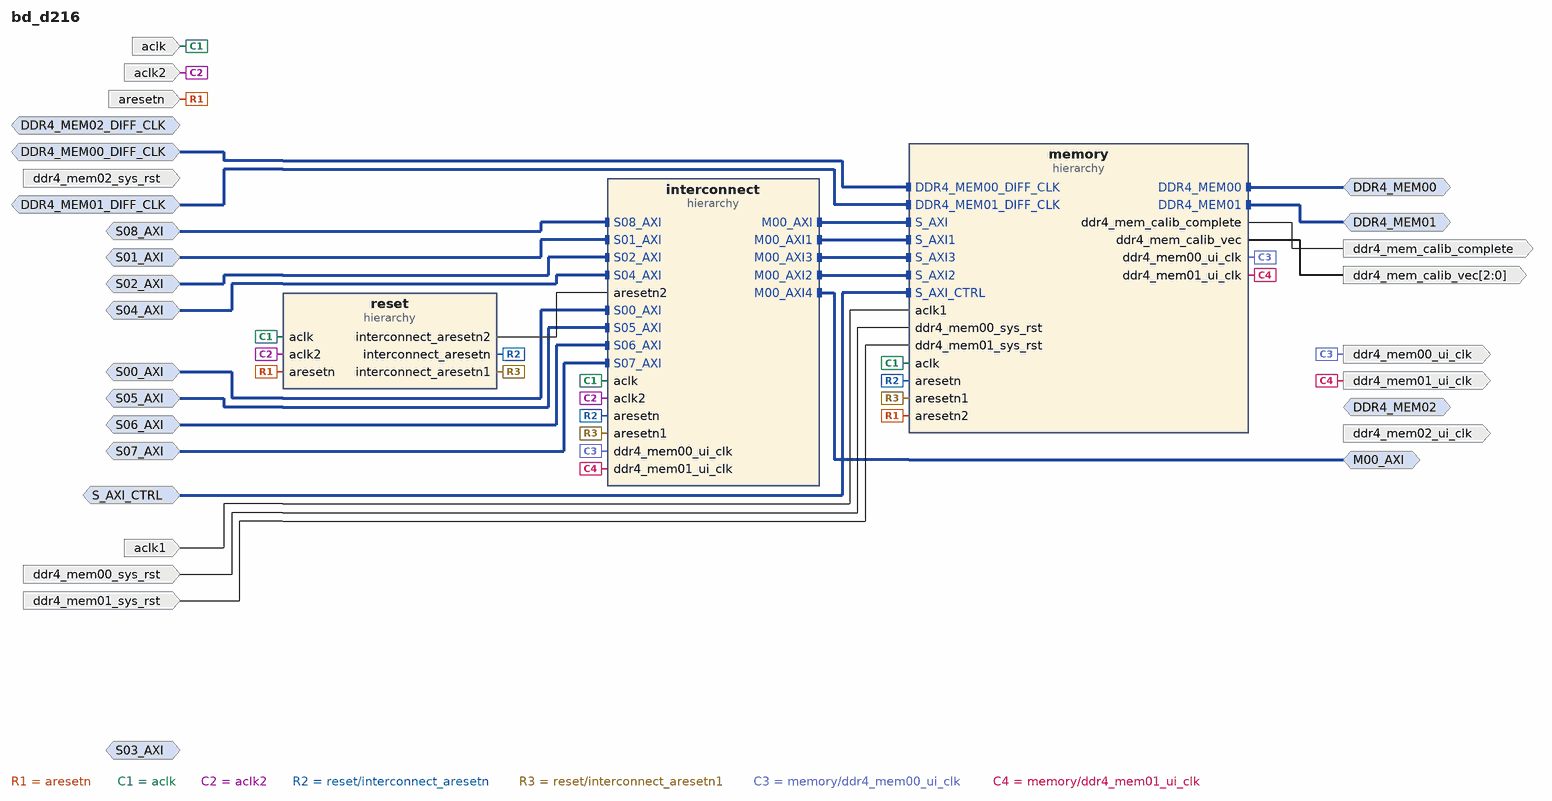
[diagram p0: block diagram of the top level]
# Vivado block design bd_d216, xcu200-fsgd2104-2-e, Vivado 2020.2
create_bd_design bd_d216

create_bd_intf_port -mode Slave -vlnv xilinx.com:interface:aximm_rtl:1.0 S_AXI_CTRL
set_property -dict {CONFIG.ADDR_WIDTH 25 CONFIG.PROTOCOL AXI4LITE} [get_bd_intf_ports S_AXI_CTRL]
create_bd_intf_port -mode Slave -vlnv xilinx.com:interface:aximm_rtl:1.0 S00_AXI
set_property -dict {CONFIG.ADDR_WIDTH 39} [get_bd_intf_ports S00_AXI]
create_bd_intf_port -mode Slave -vlnv xilinx.com:interface:aximm_rtl:1.0 S01_AXI
set_property -dict {CONFIG.ADDR_WIDTH 39} [get_bd_intf_ports S01_AXI]
create_bd_intf_port -mode Slave -vlnv xilinx.com:interface:aximm_rtl:1.0 S02_AXI
set_property -dict {CONFIG.ADDR_WIDTH 39} [get_bd_intf_ports S02_AXI]
create_bd_intf_port -mode Slave -vlnv xilinx.com:interface:aximm_rtl:1.0 S03_AXI
set_property -dict {CONFIG.ADDR_WIDTH 39} [get_bd_intf_ports S03_AXI]
create_bd_intf_port -mode Slave -vlnv xilinx.com:interface:aximm_rtl:1.0 S04_AXI
set_property -dict {CONFIG.ADDR_WIDTH 38} [get_bd_intf_ports S04_AXI]
create_bd_intf_port -mode Slave -vlnv xilinx.com:interface:aximm_rtl:1.0 S05_AXI
set_property -dict {CONFIG.ADDR_WIDTH 39} [get_bd_intf_ports S05_AXI]
create_bd_intf_port -mode Slave -vlnv xilinx.com:interface:aximm_rtl:1.0 S06_AXI
set_property -dict {CONFIG.ADDR_WIDTH 39} [get_bd_intf_ports S06_AXI]
create_bd_intf_port -mode Slave -vlnv xilinx.com:interface:aximm_rtl:1.0 S07_AXI
set_property -dict {CONFIG.ADDR_WIDTH 39} [get_bd_intf_ports S07_AXI]
create_bd_intf_port -mode Slave -vlnv xilinx.com:interface:aximm_rtl:1.0 S08_AXI
set_property -dict {CONFIG.ADDR_WIDTH 38} [get_bd_intf_ports S08_AXI]
create_bd_intf_port -mode Master -vlnv xilinx.com:interface:ddr4_rtl:1.0 DDR4_MEM00
create_bd_intf_port -mode Master -vlnv xilinx.com:interface:ddr4_rtl:1.0 DDR4_MEM01
create_bd_intf_port -mode Master -vlnv xilinx.com:interface:ddr4_rtl:1.0 DDR4_MEM02
create_bd_intf_port -mode Slave -vlnv xilinx.com:interface:diff_clock_rtl:1.0 DDR4_MEM00_DIFF_CLK
set_property -dict {CONFIG.FREQ_HZ 300000000} [get_bd_intf_ports DDR4_MEM00_DIFF_CLK]
create_bd_intf_port -mode Slave -vlnv xilinx.com:interface:diff_clock_rtl:1.0 DDR4_MEM01_DIFF_CLK
set_property -dict {CONFIG.FREQ_HZ 300000000} [get_bd_intf_ports DDR4_MEM01_DIFF_CLK]
create_bd_intf_port -mode Slave -vlnv xilinx.com:interface:diff_clock_rtl:1.0 DDR4_MEM02_DIFF_CLK
set_property -dict {CONFIG.FREQ_HZ 300000000} [get_bd_intf_ports DDR4_MEM02_DIFF_CLK]
create_bd_intf_port -mode Master -vlnv xilinx.com:interface:aximm_rtl:1.0 M00_AXI
set_property -dict {CONFIG.ADDR_WIDTH 39} [get_bd_intf_ports M00_AXI]
create_bd_port -dir I -type clk aclk
set_property -dict [list \
  CONFIG.ASSOCIATED_BUSIF S00_AXI:S01_AXI:S02_AXI:S03_AXI:S04_AXI:S05_AXI:S06_AXI:S07_AXI:S08_AXI \
] [get_bd_ports aclk]
create_bd_port -dir I -type clk aclk1
set_property -dict {CONFIG.ASSOCIATED_BUSIF S_AXI_CTRL} [get_bd_ports aclk1]
create_bd_port -dir I -type clk aclk2
set_property -dict {CONFIG.ASSOCIATED_BUSIF M00_AXI} [get_bd_ports aclk2]
create_bd_port -dir I -type rst aresetn
create_bd_port -dir O -type clk ddr4_mem00_ui_clk
create_bd_port -dir O -type clk ddr4_mem01_ui_clk
create_bd_port -dir O -type clk ddr4_mem02_ui_clk
create_bd_port -dir I -type rst ddr4_mem00_sys_rst
set_property -dict {CONFIG.POLARITY ACTIVE_HIGH} [get_bd_ports ddr4_mem00_sys_rst]
create_bd_port -dir I -type rst ddr4_mem01_sys_rst
set_property -dict {CONFIG.POLARITY ACTIVE_HIGH} [get_bd_ports ddr4_mem01_sys_rst]
create_bd_port -dir I -type rst ddr4_mem02_sys_rst
set_property -dict {CONFIG.POLARITY ACTIVE_HIGH} [get_bd_ports ddr4_mem02_sys_rst]
create_bd_port -dir O -type data ddr4_mem_calib_complete
create_bd_port -dir O -from 2 -to 0 -type data ddr4_mem_calib_vec

create_bd_cell -type hier reset
create_bd_cell -type hier interconnect
create_bd_cell -type hier memory

# ---- hierarchy /reset ----
current_bd_instance /reset
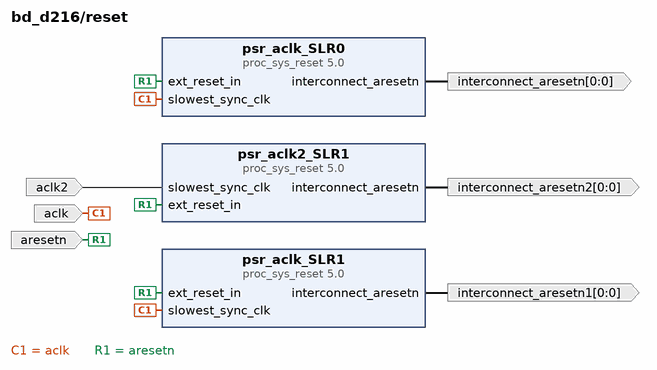
[diagram p1: block diagram inside /reset]
create_bd_pin -dir I -type clk aclk
create_bd_pin -dir I -type rst aresetn
create_bd_pin -dir O -from 0 -to 0 -type rst interconnect_aresetn
create_bd_pin -dir O -from 0 -to 0 -type rst interconnect_aresetn1
create_bd_pin -dir I -type clk aclk2
create_bd_pin -dir O -from 0 -to 0 -type rst interconnect_aresetn2

create_bd_cell -type ip -vlnv xilinx.com:ip:proc_sys_reset:5.0 psr_aclk_SLR0
set_property -dict {CONFIG.SLR_ASSIGNMENTS SLR0} [get_bd_cells psr_aclk_SLR0]
create_bd_cell -type ip -vlnv xilinx.com:ip:proc_sys_reset:5.0 psr_aclk_SLR1
set_property -dict {CONFIG.SLR_ASSIGNMENTS SLR1} [get_bd_cells psr_aclk_SLR1]
create_bd_cell -type ip -vlnv xilinx.com:ip:proc_sys_reset:5.0 psr_aclk2_SLR1
set_property -dict {CONFIG.SLR_ASSIGNMENTS SLR1} [get_bd_cells psr_aclk2_SLR1]

# ---- hierarchy /interconnect ----
current_bd_instance /interconnect
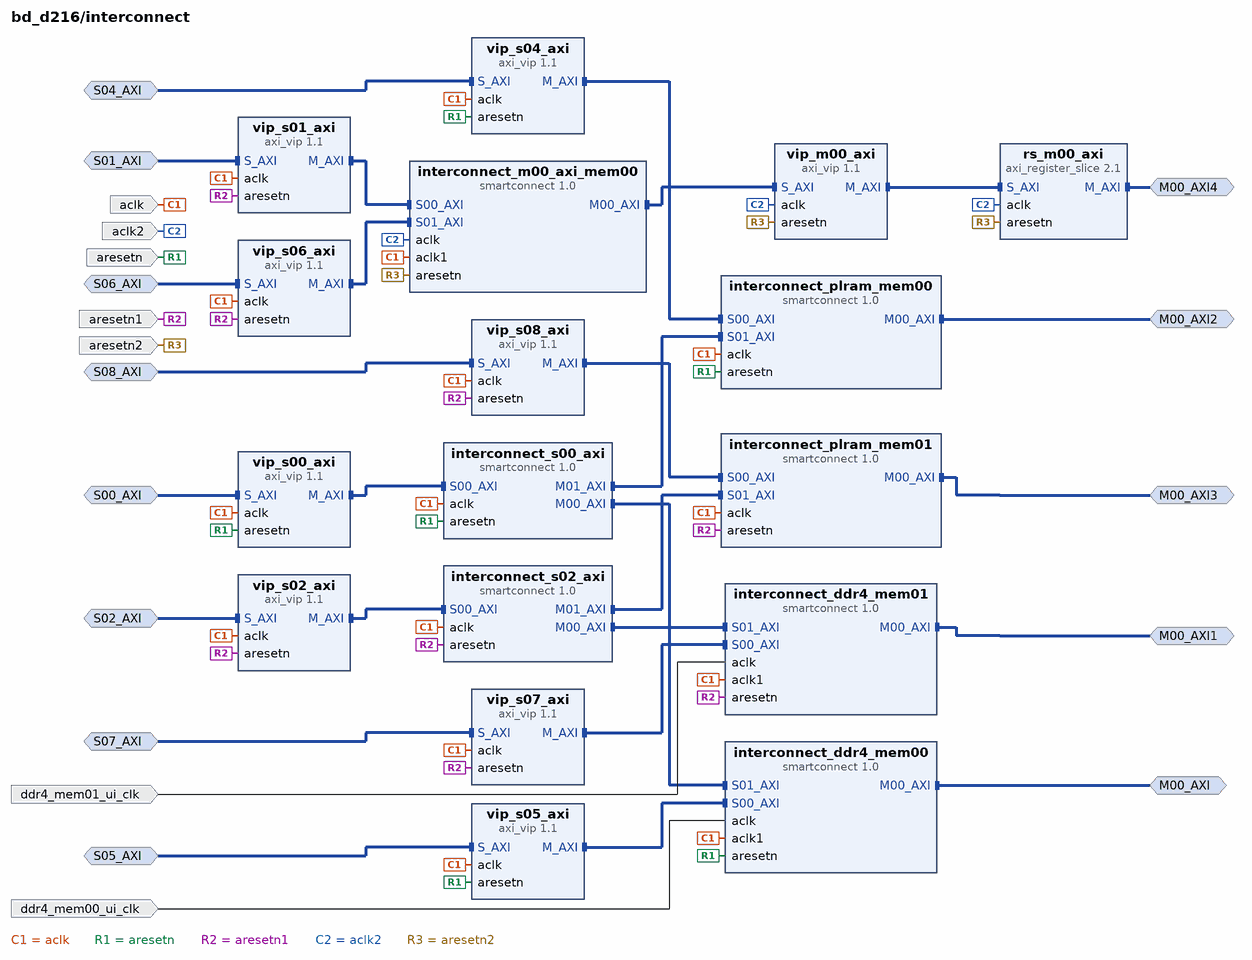
[diagram p2: block diagram inside /interconnect]
create_bd_intf_pin -mode Master -vlnv xilinx.com:interface:aximm_rtl:1.0 M00_AXI
create_bd_intf_pin -mode Master -vlnv xilinx.com:interface:aximm_rtl:1.0 M00_AXI1
create_bd_intf_pin -mode Master -vlnv xilinx.com:interface:aximm_rtl:1.0 M00_AXI2
create_bd_intf_pin -mode Master -vlnv xilinx.com:interface:aximm_rtl:1.0 M00_AXI3
create_bd_intf_pin -mode Slave -vlnv xilinx.com:interface:aximm_rtl:1.0 S00_AXI
create_bd_intf_pin -mode Slave -vlnv xilinx.com:interface:aximm_rtl:1.0 S01_AXI
create_bd_intf_pin -mode Slave -vlnv xilinx.com:interface:aximm_rtl:1.0 S02_AXI
create_bd_intf_pin -mode Slave -vlnv xilinx.com:interface:aximm_rtl:1.0 S04_AXI
create_bd_intf_pin -mode Slave -vlnv xilinx.com:interface:aximm_rtl:1.0 S05_AXI
create_bd_intf_pin -mode Slave -vlnv xilinx.com:interface:aximm_rtl:1.0 S06_AXI
create_bd_intf_pin -mode Slave -vlnv xilinx.com:interface:aximm_rtl:1.0 S07_AXI
create_bd_intf_pin -mode Slave -vlnv xilinx.com:interface:aximm_rtl:1.0 S08_AXI
create_bd_intf_pin -mode Master -vlnv xilinx.com:interface:aximm_rtl:1.0 M00_AXI4
create_bd_pin -dir I -type clk aclk
create_bd_pin -dir I -type rst aresetn
create_bd_pin -dir I -type rst aresetn1
create_bd_pin -dir I -type clk ddr4_mem00_ui_clk
create_bd_pin -dir I -type clk ddr4_mem01_ui_clk
create_bd_pin -dir I -type clk aclk2
create_bd_pin -dir I -type rst aresetn2

create_bd_cell -type ip -vlnv xilinx.com:ip:smartconnect:1.0 interconnect_s00_axi
set_property -dict [list \
  CONFIG.ADVANCED_PROPERTIES {__view__ {functional {S00_Buffer {R_SIZE 512 W_SIZE 512} S00_Entry {PKT_R_THR 512 LIM_R_LEN 256 PKT_W_THR 64 LIM_W_LEN 256}}}} \
  CONFIG.NUM_MI 2 \
  CONFIG.NUM_SI 1 \
] [get_bd_cells interconnect_s00_axi]
create_bd_cell -type ip -vlnv xilinx.com:ip:smartconnect:1.0 interconnect_s02_axi
set_property -dict [list \
  CONFIG.ADVANCED_PROPERTIES {__view__ {functional {S00_Buffer {R_SIZE 512 W_SIZE 512} S00_Entry {PKT_R_THR 512 LIM_R_LEN 256 PKT_W_THR 64 LIM_W_LEN 256}}}} \
  CONFIG.NUM_MI 2 \
  CONFIG.NUM_SI 1 \
] [get_bd_cells interconnect_s02_axi]
create_bd_cell -type ip -vlnv xilinx.com:ip:smartconnect:1.0 interconnect_ddr4_mem00
set_property -dict [list \
  CONFIG.ADVANCED_PROPERTIES {__view__ {functional {S00_Buffer {R_SIZE 512 W_SIZE 512} S00_Entry {PKT_R_THR 512 LIM_R_LEN 256 PKT_W_THR 64 LIM_W_LEN 256}}}} \
  CONFIG.NUM_CLKS 2 \
  CONFIG.NUM_SI 2 \
] [get_bd_cells interconnect_ddr4_mem00]
create_bd_cell -type ip -vlnv xilinx.com:ip:smartconnect:1.0 interconnect_ddr4_mem01
set_property -dict [list \
  CONFIG.ADVANCED_PROPERTIES {__view__ {functional {S00_Buffer {R_SIZE 512 W_SIZE 512} S00_Entry {PKT_R_THR 512 LIM_R_LEN 256 PKT_W_THR 64 LIM_W_LEN 256}}}} \
  CONFIG.NUM_CLKS 2 \
  CONFIG.NUM_SI 2 \
] [get_bd_cells interconnect_ddr4_mem01]
create_bd_cell -type ip -vlnv xilinx.com:ip:smartconnect:1.0 interconnect_m00_axi_mem00
set_property -dict [list \
  CONFIG.ADVANCED_PROPERTIES {__view__ {functional {S00_Buffer {R_SIZE 512 W_SIZE 512} S00_Entry {PKT_R_THR 512 LIM_R_LEN 256 PKT_W_THR 64 LIM_W_LEN 256} S01_Buffer {R_SIZE 512 W_SIZE 512} S01_Entry {PKT_R_THR 512 LIM_R_LEN 256 PKT_W_THR 64 LIM_W_LEN 256}}}} \
  CONFIG.NUM_CLKS 2 \
  CONFIG.NUM_SI 2 \
] [get_bd_cells interconnect_m00_axi_mem00]
create_bd_cell -type ip -vlnv xilinx.com:ip:smartconnect:1.0 interconnect_plram_mem00
set_property -dict [list \
  CONFIG.ADVANCED_PROPERTIES {__view__ {functional {S00_Buffer {R_SIZE 512 W_SIZE 512} S00_Entry {PKT_R_THR 512 LIM_R_LEN 256 PKT_W_THR 64 LIM_W_LEN 256}}}} \
  CONFIG.NUM_CLKS 1 \
  CONFIG.NUM_SI 2 \
] [get_bd_cells interconnect_plram_mem00]
create_bd_cell -type ip -vlnv xilinx.com:ip:smartconnect:1.0 interconnect_plram_mem01
set_property -dict [list \
  CONFIG.ADVANCED_PROPERTIES {__view__ {functional {S00_Buffer {R_SIZE 512 W_SIZE 512} S00_Entry {PKT_R_THR 512 LIM_R_LEN 256 PKT_W_THR 64 LIM_W_LEN 256}}}} \
  CONFIG.NUM_CLKS 1 \
  CONFIG.NUM_SI 2 \
] [get_bd_cells interconnect_plram_mem01]
create_bd_cell -type ip -vlnv xilinx.com:ip:axi_vip:1.1 vip_s00_axi
create_bd_cell -type ip -vlnv xilinx.com:ip:axi_vip:1.1 vip_s01_axi
create_bd_cell -type ip -vlnv xilinx.com:ip:axi_vip:1.1 vip_s02_axi
create_bd_cell -type ip -vlnv xilinx.com:ip:axi_vip:1.1 vip_s04_axi
create_bd_cell -type ip -vlnv xilinx.com:ip:axi_vip:1.1 vip_s05_axi
create_bd_cell -type ip -vlnv xilinx.com:ip:axi_vip:1.1 vip_s06_axi
create_bd_cell -type ip -vlnv xilinx.com:ip:axi_vip:1.1 vip_s07_axi
create_bd_cell -type ip -vlnv xilinx.com:ip:axi_vip:1.1 vip_s08_axi
create_bd_cell -type ip -vlnv xilinx.com:ip:axi_vip:1.1 vip_m00_axi
create_bd_cell -type ip -vlnv xilinx.com:ip:axi_register_slice:2.1 rs_m00_axi
set_property -dict [list \
  CONFIG.ADDR_WIDTH 39 \
  CONFIG.ARUSER_WIDTH 0 \
  CONFIG.AWUSER_WIDTH 0 \
  CONFIG.BUSER_WIDTH 0 \
  CONFIG.DATA_WIDTH 512 \
  CONFIG.HAS_BRESP 1 \
  CONFIG.HAS_BURST 1 \
  CONFIG.HAS_CACHE 1 \
  CONFIG.HAS_LOCK 1 \
  CONFIG.HAS_PROT 1 \
  CONFIG.HAS_QOS 1 \
  CONFIG.HAS_REGION 1 \
  CONFIG.HAS_RRESP 1 \
  CONFIG.HAS_WSTRB 1 \
  CONFIG.ID_WIDTH 0 \
  CONFIG.MAX_BURST_LENGTH 256 \
  CONFIG.NUM_READ_OUTSTANDING 16 \
  CONFIG.NUM_READ_THREADS 1 \
  CONFIG.NUM_WRITE_OUTSTANDING 16 \
  CONFIG.NUM_WRITE_THREADS 1 \
  CONFIG.PROTOCOL AXI4 \
  CONFIG.READ_WRITE_MODE READ_WRITE \
  CONFIG.REG_AR 0 \
  CONFIG.REG_AW 0 \
  CONFIG.REG_B 0 \
  CONFIG.REG_R 0 \
  CONFIG.REG_W 0 \
  CONFIG.RUSER_BITS_PER_BYTE 0 \
  CONFIG.RUSER_WIDTH 0 \
  CONFIG.SUPPORTS_NARROW_BURST 1 \
  CONFIG.WUSER_BITS_PER_BYTE 0 \
  CONFIG.WUSER_WIDTH 0 \
] [get_bd_cells rs_m00_axi]

# ---- hierarchy /memory ----
current_bd_instance /memory
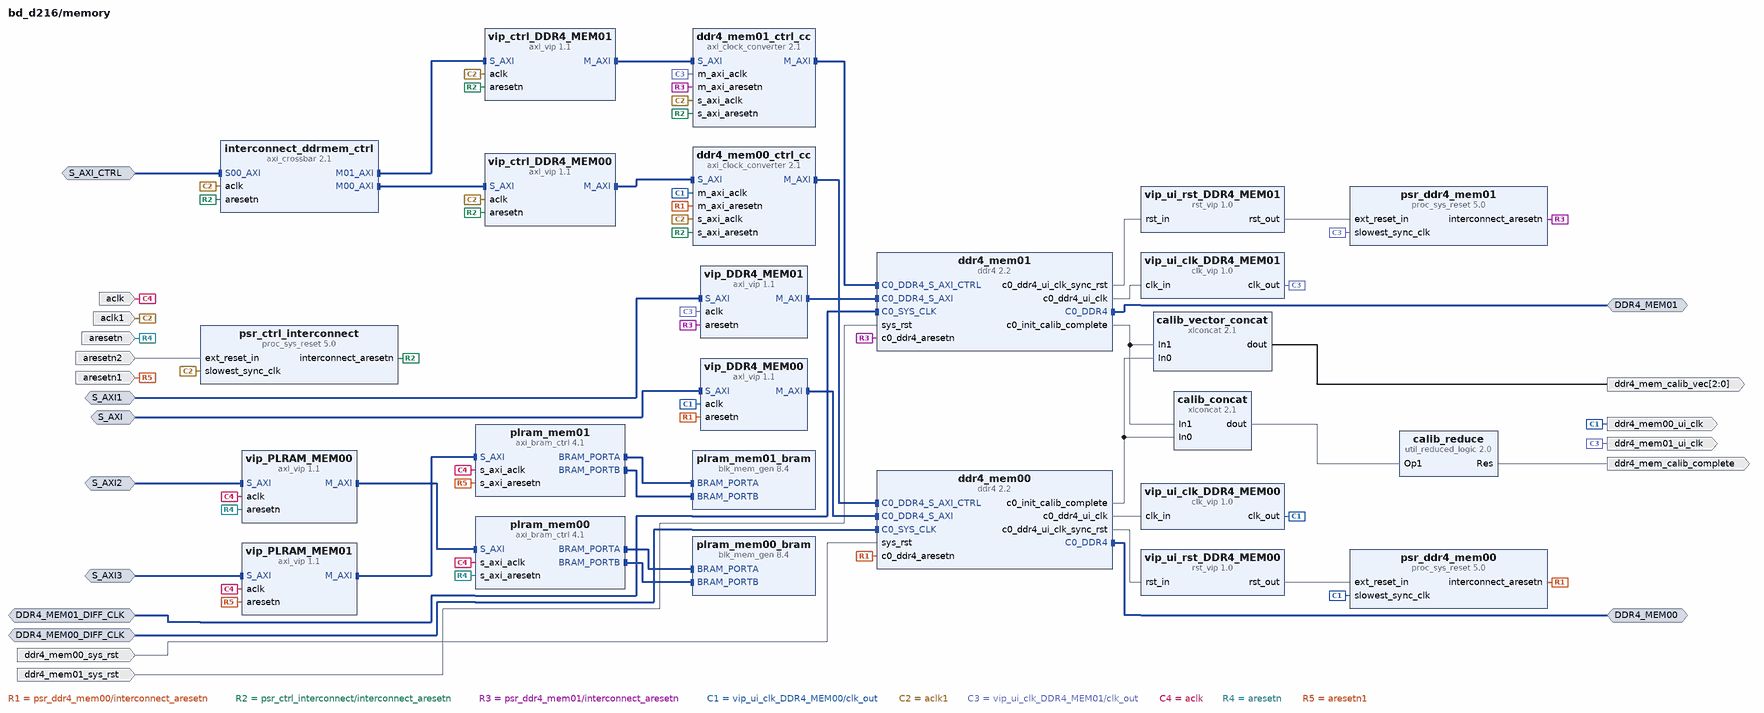
[diagram p3: block diagram inside /memory]
create_bd_intf_pin -mode Slave -vlnv xilinx.com:interface:diff_clock_rtl:1.0 DDR4_MEM00_DIFF_CLK
create_bd_intf_pin -mode Master -vlnv xilinx.com:interface:ddr4_rtl:1.0 DDR4_MEM00
create_bd_intf_pin -mode Slave -vlnv xilinx.com:interface:diff_clock_rtl:1.0 DDR4_MEM01_DIFF_CLK
create_bd_intf_pin -mode Master -vlnv xilinx.com:interface:ddr4_rtl:1.0 DDR4_MEM01
create_bd_intf_pin -mode Slave -vlnv xilinx.com:interface:aximm_rtl:1.0 S_AXI_CTRL
create_bd_intf_pin -mode Slave -vlnv xilinx.com:interface:aximm_rtl:1.0 S_AXI
create_bd_intf_pin -mode Slave -vlnv xilinx.com:interface:aximm_rtl:1.0 S_AXI1
create_bd_intf_pin -mode Slave -vlnv xilinx.com:interface:aximm_rtl:1.0 S_AXI2
create_bd_intf_pin -mode Slave -vlnv xilinx.com:interface:aximm_rtl:1.0 S_AXI3
create_bd_pin -dir I -type rst ddr4_mem00_sys_rst
create_bd_pin -dir O -type clk ddr4_mem00_ui_clk
create_bd_pin -dir I -type clk aclk1
create_bd_pin -dir I -type rst ddr4_mem01_sys_rst
create_bd_pin -dir O -type clk ddr4_mem01_ui_clk
create_bd_pin -dir O ddr4_mem_calib_complete
create_bd_pin -dir O -from 2 -to 0 ddr4_mem_calib_vec
create_bd_pin -dir I -type clk aclk
create_bd_pin -dir I -type rst aresetn
create_bd_pin -dir I -type rst aresetn1
create_bd_pin -dir I -type rst aresetn2

create_bd_cell -type ip -vlnv xilinx.com:ip:ddr4:2.2 ddr4_mem00
set_property -dict [list \
  CONFIG.ADDN_UI_CLKOUT1_FREQ_HZ 100 \
  CONFIG.C0.BANK_GROUP_WIDTH 2 \
  CONFIG.C0.CKE_WIDTH 1 \
  CONFIG.C0.CS_WIDTH 1 \
  CONFIG.C0.DDR4_AUTO_AP_COL_A3 true \
  CONFIG.C0.DDR4_AxiAddressWidth 34 \
  CONFIG.C0.DDR4_Mem_Add_Map ROW_COLUMN_BANK_INTLV \
  CONFIG.C0.ODT_WIDTH 1 \
  CONFIG.C0_CLOCK_BOARD_INTERFACE default_300mhz_clk0 \
  CONFIG.C0_DDR4_BOARD_INTERFACE ddr4_sdram_c0 \
] [get_bd_cells ddr4_mem00]
create_bd_cell -type ip -vlnv xilinx.com:ip:proc_sys_reset:5.0 psr_ddr4_mem00
create_bd_cell -type ip -vlnv xilinx.com:ip:axi_clock_converter:2.1 ddr4_mem00_ctrl_cc
create_bd_cell -type ip -vlnv xilinx.com:ip:ddr4:2.2 ddr4_mem01
set_property -dict [list \
  CONFIG.ADDN_UI_CLKOUT1_FREQ_HZ 100 \
  CONFIG.C0.BANK_GROUP_WIDTH 2 \
  CONFIG.C0.CKE_WIDTH 1 \
  CONFIG.C0.CS_WIDTH 1 \
  CONFIG.C0.DDR4_AUTO_AP_COL_A3 true \
  CONFIG.C0.DDR4_AxiAddressWidth 34 \
  CONFIG.C0.DDR4_Mem_Add_Map ROW_COLUMN_BANK_INTLV \
  CONFIG.C0.ODT_WIDTH 1 \
  CONFIG.C0_CLOCK_BOARD_INTERFACE default_300mhz_clk2 \
  CONFIG.C0_DDR4_BOARD_INTERFACE ddr4_sdram_c2 \
] [get_bd_cells ddr4_mem01]
create_bd_cell -type ip -vlnv xilinx.com:ip:proc_sys_reset:5.0 psr_ddr4_mem01
create_bd_cell -type ip -vlnv xilinx.com:ip:axi_clock_converter:2.1 ddr4_mem01_ctrl_cc
create_bd_cell -type ip -vlnv xilinx.com:ip:xlconcat:2.1 calib_concat
set_property -dict {CONFIG.NUM_PORTS 2} [get_bd_cells calib_concat]
create_bd_cell -type ip -vlnv xilinx.com:ip:util_reduced_logic:2.0 calib_reduce
set_property -dict {CONFIG.C_OPERATION and CONFIG.C_SIZE 2} [get_bd_cells calib_reduce]
create_bd_cell -type ip -vlnv xilinx.com:ip:xlconcat:2.1 calib_vector_concat
set_property -dict {CONFIG.NUM_PORTS 3} [get_bd_cells calib_vector_concat]
create_bd_cell -type ip -vlnv xilinx.com:ip:axi_bram_ctrl:4.1 plram_mem00
set_property -dict {CONFIG.DATA_WIDTH 512 CONFIG.SLR_ASSIGNMENTS SLR0} [get_bd_cells plram_mem00]
create_bd_cell -type ip -vlnv xilinx.com:ip:blk_mem_gen:8.4 plram_mem00_bram
set_property -dict {CONFIG.Memory_Type True_Dual_Port_RAM CONFIG.SLR_ASSIGNMENTS SLR0} [get_bd_cells plram_mem00_bram]
create_bd_cell -type ip -vlnv xilinx.com:ip:axi_bram_ctrl:4.1 plram_mem01
set_property -dict {CONFIG.DATA_WIDTH 512 CONFIG.SLR_ASSIGNMENTS SLR1} [get_bd_cells plram_mem01]
create_bd_cell -type ip -vlnv xilinx.com:ip:blk_mem_gen:8.4 plram_mem01_bram
set_property -dict {CONFIG.Memory_Type True_Dual_Port_RAM CONFIG.SLR_ASSIGNMENTS SLR1} [get_bd_cells plram_mem01_bram]
create_bd_cell -type ip -vlnv xilinx.com:ip:proc_sys_reset:5.0 psr_ctrl_interconnect
create_bd_cell -type ip -vlnv xilinx.com:ip:axi_crossbar:2.1 interconnect_ddrmem_ctrl
set_property -dict {CONFIG.NUM_MI 2 CONFIG.NUM_SI 1 CONFIG.STRATEGY 1} [get_bd_cells interconnect_ddrmem_ctrl]
create_bd_cell -type ip -vlnv xilinx.com:ip:axi_vip:1.1 vip_DDR4_MEM00
create_bd_cell -type ip -vlnv xilinx.com:ip:clk_vip:1.0 vip_ui_clk_DDR4_MEM00
create_bd_cell -type ip -vlnv xilinx.com:ip:rst_vip:1.0 vip_ui_rst_DDR4_MEM00
create_bd_cell -type ip -vlnv xilinx.com:ip:axi_vip:1.1 vip_ctrl_DDR4_MEM00
create_bd_cell -type ip -vlnv xilinx.com:ip:axi_vip:1.1 vip_DDR4_MEM01
create_bd_cell -type ip -vlnv xilinx.com:ip:clk_vip:1.0 vip_ui_clk_DDR4_MEM01
create_bd_cell -type ip -vlnv xilinx.com:ip:rst_vip:1.0 vip_ui_rst_DDR4_MEM01
create_bd_cell -type ip -vlnv xilinx.com:ip:axi_vip:1.1 vip_ctrl_DDR4_MEM01
create_bd_cell -type ip -vlnv xilinx.com:ip:axi_vip:1.1 vip_PLRAM_MEM00
create_bd_cell -type ip -vlnv xilinx.com:ip:axi_vip:1.1 vip_PLRAM_MEM01

# ---- connections ----

current_bd_instance /reset
connect_bd_net [get_bd_pins aclk] [get_bd_pins psr_aclk_SLR1/slowest_sync_clk] [get_bd_pins psr_aclk_SLR0/slowest_sync_clk]
connect_bd_net [get_bd_pins aresetn] \
  [get_bd_pins psr_aclk_SLR1/ext_reset_in] [get_bd_pins psr_aclk2_SLR1/ext_reset_in] [get_bd_pins psr_aclk_SLR0/ext_reset_in]
connect_bd_net [get_bd_pins psr_aclk_SLR0/interconnect_aresetn] [get_bd_pins interconnect_aresetn]
connect_bd_net [get_bd_pins psr_aclk_SLR1/interconnect_aresetn] [get_bd_pins interconnect_aresetn1]
connect_bd_net -net aclk2_1 [get_bd_pins aclk2] [get_bd_pins psr_aclk2_SLR1/slowest_sync_clk]
connect_bd_net [get_bd_pins psr_aclk2_SLR1/interconnect_aresetn] [get_bd_pins interconnect_aresetn2]

current_bd_instance /interconnect
connect_bd_intf_net [get_bd_intf_pins M00_AXI] [get_bd_intf_pins interconnect_ddr4_mem00/M00_AXI]
connect_bd_intf_net [get_bd_intf_pins M00_AXI2] [get_bd_intf_pins interconnect_plram_mem00/M00_AXI]
connect_bd_intf_net [get_bd_intf_pins interconnect_s02_axi/M01_AXI] [get_bd_intf_pins interconnect_plram_mem01/S01_AXI]
connect_bd_intf_net [get_bd_intf_pins interconnect_s00_axi/M01_AXI] [get_bd_intf_pins interconnect_plram_mem00/S01_AXI]
connect_bd_intf_net [get_bd_intf_pins interconnect_s02_axi/M00_AXI] [get_bd_intf_pins interconnect_ddr4_mem01/S01_AXI]
connect_bd_intf_net [get_bd_intf_pins interconnect_s00_axi/M00_AXI] [get_bd_intf_pins interconnect_ddr4_mem00/S01_AXI]
connect_bd_intf_net [get_bd_intf_pins M00_AXI3] [get_bd_intf_pins interconnect_plram_mem01/M00_AXI]
connect_bd_intf_net [get_bd_intf_pins M00_AXI1] [get_bd_intf_pins interconnect_ddr4_mem01/M00_AXI]
connect_bd_intf_net [get_bd_intf_pins vip_m00_axi/M_AXI] [get_bd_intf_pins rs_m00_axi/S_AXI]
connect_bd_intf_net [get_bd_intf_pins interconnect_ddr4_mem01/S00_AXI] [get_bd_intf_pins vip_s07_axi/M_AXI]
connect_bd_intf_net [get_bd_intf_pins interconnect_plram_mem01/S00_AXI] [get_bd_intf_pins vip_s08_axi/M_AXI]
connect_bd_intf_net [get_bd_intf_pins interconnect_m00_axi_mem00/M00_AXI] [get_bd_intf_pins vip_m00_axi/S_AXI]
connect_bd_intf_net [get_bd_intf_pins interconnect_s00_axi/S00_AXI] [get_bd_intf_pins vip_s00_axi/M_AXI]
connect_bd_intf_net [get_bd_intf_pins interconnect_m00_axi_mem00/S00_AXI] [get_bd_intf_pins vip_s01_axi/M_AXI]
connect_bd_intf_net [get_bd_intf_pins interconnect_s02_axi/S00_AXI] [get_bd_intf_pins vip_s02_axi/M_AXI]
connect_bd_intf_net [get_bd_intf_pins interconnect_plram_mem00/S00_AXI] [get_bd_intf_pins vip_s04_axi/M_AXI]
connect_bd_intf_net [get_bd_intf_pins interconnect_ddr4_mem00/S00_AXI] [get_bd_intf_pins vip_s05_axi/M_AXI]
connect_bd_intf_net [get_bd_intf_pins interconnect_m00_axi_mem00/S01_AXI] [get_bd_intf_pins vip_s06_axi/M_AXI]
connect_bd_intf_net [get_bd_intf_pins S00_AXI] [get_bd_intf_pins vip_s00_axi/S_AXI]
connect_bd_intf_net [get_bd_intf_pins S01_AXI] [get_bd_intf_pins vip_s01_axi/S_AXI]
connect_bd_intf_net [get_bd_intf_pins S02_AXI] [get_bd_intf_pins vip_s02_axi/S_AXI]
connect_bd_intf_net [get_bd_intf_pins S04_AXI] [get_bd_intf_pins vip_s04_axi/S_AXI]
connect_bd_intf_net [get_bd_intf_pins S05_AXI] [get_bd_intf_pins vip_s05_axi/S_AXI]
connect_bd_intf_net [get_bd_intf_pins S06_AXI] [get_bd_intf_pins vip_s06_axi/S_AXI]
connect_bd_intf_net [get_bd_intf_pins S07_AXI] [get_bd_intf_pins vip_s07_axi/S_AXI]
connect_bd_intf_net [get_bd_intf_pins S08_AXI] [get_bd_intf_pins vip_s08_axi/S_AXI]
connect_bd_intf_net [get_bd_intf_pins M00_AXI4] [get_bd_intf_pins rs_m00_axi/M_AXI]
connect_bd_net [get_bd_pins aclk] \
  [get_bd_pins interconnect_s02_axi/aclk] [get_bd_pins interconnect_ddr4_mem00/aclk1] \
  [get_bd_pins interconnect_ddr4_mem01/aclk1] [get_bd_pins interconnect_plram_mem00/aclk] \
  [get_bd_pins interconnect_plram_mem01/aclk] [get_bd_pins interconnect_m00_axi_mem00/aclk1] [get_bd_pins vip_s00_axi/aclk] \
  [get_bd_pins vip_s01_axi/aclk] [get_bd_pins vip_s02_axi/aclk] [get_bd_pins vip_s04_axi/aclk] [get_bd_pins vip_s05_axi/aclk] \
  [get_bd_pins vip_s06_axi/aclk] [get_bd_pins vip_s07_axi/aclk] [get_bd_pins vip_s08_axi/aclk] \
  [get_bd_pins interconnect_s00_axi/aclk]
connect_bd_net -net psr_aclk_SLR0_interconnect_aresetn [get_bd_pins aresetn] \
  [get_bd_pins interconnect_ddr4_mem00/aresetn] [get_bd_pins interconnect_plram_mem00/aresetn] \
  [get_bd_pins vip_s00_axi/aresetn] [get_bd_pins vip_s04_axi/aresetn] [get_bd_pins vip_s05_axi/aresetn] \
  [get_bd_pins interconnect_s00_axi/aresetn]
connect_bd_net -net psr_aclk_SLR1_interconnect_aresetn [get_bd_pins aresetn1] \
  [get_bd_pins interconnect_ddr4_mem01/aresetn] [get_bd_pins interconnect_plram_mem01/aresetn] \
  [get_bd_pins vip_s01_axi/aresetn] [get_bd_pins vip_s02_axi/aresetn] [get_bd_pins vip_s06_axi/aresetn] \
  [get_bd_pins vip_s07_axi/aresetn] [get_bd_pins vip_s08_axi/aresetn] [get_bd_pins interconnect_s02_axi/aresetn]
connect_bd_net -net vip_ui_clk_DDR4_MEM00_clk_out [get_bd_pins ddr4_mem00_ui_clk] [get_bd_pins interconnect_ddr4_mem00/aclk]
connect_bd_net -net vip_ui_clk_DDR4_MEM01_clk_out [get_bd_pins ddr4_mem01_ui_clk] [get_bd_pins interconnect_ddr4_mem01/aclk]
connect_bd_net -net aclk2_1 [get_bd_pins aclk2] \
  [get_bd_pins vip_m00_axi/aclk] [get_bd_pins rs_m00_axi/aclk] [get_bd_pins interconnect_m00_axi_mem00/aclk]
connect_bd_net -net psr_aclk2_SLR1_interconnect_aresetn [get_bd_pins aresetn2] \
  [get_bd_pins vip_m00_axi/aresetn] [get_bd_pins rs_m00_axi/aresetn] [get_bd_pins interconnect_m00_axi_mem00/aresetn]

current_bd_instance /memory
connect_bd_intf_net [get_bd_intf_pins ddr4_mem00_ctrl_cc/M_AXI] [get_bd_intf_pins ddr4_mem00/C0_DDR4_S_AXI_CTRL]
connect_bd_intf_net [get_bd_intf_pins ddr4_mem00/C0_DDR4_S_AXI] [get_bd_intf_pins vip_DDR4_MEM00/M_AXI]
connect_bd_intf_net [get_bd_intf_pins ddr4_mem01/C0_DDR4_S_AXI] [get_bd_intf_pins vip_DDR4_MEM01/M_AXI]
connect_bd_intf_net [get_bd_intf_pins ddr4_mem01_ctrl_cc/M_AXI] [get_bd_intf_pins ddr4_mem01/C0_DDR4_S_AXI_CTRL]
connect_bd_intf_net [get_bd_intf_pins interconnect_ddrmem_ctrl/M00_AXI] [get_bd_intf_pins vip_ctrl_DDR4_MEM00/S_AXI]
connect_bd_intf_net [get_bd_intf_pins plram_mem01/S_AXI] [get_bd_intf_pins vip_PLRAM_MEM01/M_AXI]
connect_bd_intf_net [get_bd_intf_pins plram_mem00_bram/BRAM_PORTA] [get_bd_intf_pins plram_mem00/BRAM_PORTA]
connect_bd_intf_net [get_bd_intf_pins plram_mem00_bram/BRAM_PORTB] [get_bd_intf_pins plram_mem00/BRAM_PORTB]
connect_bd_intf_net [get_bd_intf_pins plram_mem00/S_AXI] [get_bd_intf_pins vip_PLRAM_MEM00/M_AXI]
connect_bd_intf_net [get_bd_intf_pins ddr4_mem00_ctrl_cc/S_AXI] [get_bd_intf_pins vip_ctrl_DDR4_MEM00/M_AXI]
connect_bd_intf_net [get_bd_intf_pins ddr4_mem01_ctrl_cc/S_AXI] [get_bd_intf_pins vip_ctrl_DDR4_MEM01/M_AXI]
connect_bd_intf_net [get_bd_intf_pins plram_mem01_bram/BRAM_PORTA] [get_bd_intf_pins plram_mem01/BRAM_PORTA]
connect_bd_intf_net [get_bd_intf_pins plram_mem01_bram/BRAM_PORTB] [get_bd_intf_pins plram_mem01/BRAM_PORTB]
connect_bd_intf_net [get_bd_intf_pins DDR4_MEM01_DIFF_CLK] [get_bd_intf_pins ddr4_mem01/C0_SYS_CLK]
connect_bd_intf_net [get_bd_intf_pins DDR4_MEM00_DIFF_CLK] [get_bd_intf_pins ddr4_mem00/C0_SYS_CLK]
connect_bd_intf_net [get_bd_intf_pins DDR4_MEM00] [get_bd_intf_pins ddr4_mem00/C0_DDR4]
connect_bd_intf_net [get_bd_intf_pins DDR4_MEM01] [get_bd_intf_pins ddr4_mem01/C0_DDR4]
connect_bd_intf_net [get_bd_intf_pins S_AXI_CTRL] [get_bd_intf_pins interconnect_ddrmem_ctrl/S00_AXI]
connect_bd_intf_net -intf_net interconnect_DDR4_MEM00_M00_AXI [get_bd_intf_pins S_AXI] [get_bd_intf_pins vip_DDR4_MEM00/S_AXI]
connect_bd_intf_net -intf_net interconnect_DDR4_MEM01_M00_AXI [get_bd_intf_pins S_AXI1] [get_bd_intf_pins vip_DDR4_MEM01/S_AXI]
connect_bd_intf_net -intf_net interconnect_PLRAM_MEM00_M00_AXI [get_bd_intf_pins S_AXI2] [get_bd_intf_pins vip_PLRAM_MEM00/S_AXI]
connect_bd_intf_net -intf_net interconnect_PLRAM_MEM01_M00_AXI [get_bd_intf_pins S_AXI3] [get_bd_intf_pins vip_PLRAM_MEM01/S_AXI]
connect_bd_intf_net [get_bd_intf_pins interconnect_ddrmem_ctrl/M01_AXI] [get_bd_intf_pins vip_ctrl_DDR4_MEM01/S_AXI]
connect_bd_net [get_bd_pins ddr4_mem00/c0_init_calib_complete] [get_bd_pins calib_concat/In0] [get_bd_pins calib_vector_concat/In0]
connect_bd_net [get_bd_pins ddr4_mem00/c0_ddr4_ui_clk] [get_bd_pins vip_ui_clk_DDR4_MEM00/clk_in]
connect_bd_net [get_bd_pins ddr4_mem00/c0_ddr4_ui_clk_sync_rst] [get_bd_pins vip_ui_rst_DDR4_MEM00/rst_in]
connect_bd_net [get_bd_pins psr_ddr4_mem00/interconnect_aresetn] \
  [get_bd_pins ddr4_mem00/c0_ddr4_aresetn] [get_bd_pins ddr4_mem00_ctrl_cc/m_axi_aresetn] \
  [get_bd_pins vip_DDR4_MEM00/aresetn]
connect_bd_net [get_bd_pins vip_ui_rst_DDR4_MEM00/rst_out] [get_bd_pins psr_ddr4_mem00/ext_reset_in]
connect_bd_net [get_bd_pins psr_ctrl_interconnect/interconnect_aresetn] \
  [get_bd_pins ddr4_mem00_ctrl_cc/s_axi_aresetn] [get_bd_pins ddr4_mem01_ctrl_cc/s_axi_aresetn] \
  [get_bd_pins interconnect_ddrmem_ctrl/aresetn] [get_bd_pins vip_ctrl_DDR4_MEM00/aresetn] \
  [get_bd_pins vip_ctrl_DDR4_MEM01/aresetn]
connect_bd_net [get_bd_pins ddr4_mem01/c0_init_calib_complete] [get_bd_pins calib_concat/In1] [get_bd_pins calib_vector_concat/In1]
connect_bd_net [get_bd_pins ddr4_mem01/c0_ddr4_ui_clk] [get_bd_pins vip_ui_clk_DDR4_MEM01/clk_in]
connect_bd_net [get_bd_pins ddr4_mem01/c0_ddr4_ui_clk_sync_rst] [get_bd_pins vip_ui_rst_DDR4_MEM01/rst_in]
connect_bd_net [get_bd_pins psr_ddr4_mem01/interconnect_aresetn] \
  [get_bd_pins ddr4_mem01/c0_ddr4_aresetn] [get_bd_pins ddr4_mem01_ctrl_cc/m_axi_aresetn] \
  [get_bd_pins vip_DDR4_MEM01/aresetn]
connect_bd_net [get_bd_pins vip_ui_rst_DDR4_MEM01/rst_out] [get_bd_pins psr_ddr4_mem01/ext_reset_in]
connect_bd_net [get_bd_pins calib_concat/dout] [get_bd_pins calib_reduce/Op1]
connect_bd_net [get_bd_pins ddr4_mem00_sys_rst] [get_bd_pins ddr4_mem00/sys_rst]
connect_bd_net [get_bd_pins vip_ui_clk_DDR4_MEM00/clk_out] \
  [get_bd_pins ddr4_mem00_ui_clk] [get_bd_pins ddr4_mem00_ctrl_cc/m_axi_aclk] [get_bd_pins vip_DDR4_MEM00/aclk] \
  [get_bd_pins psr_ddr4_mem00/slowest_sync_clk]
connect_bd_net -net aclk1_1 [get_bd_pins aclk1] \
  [get_bd_pins ddr4_mem01_ctrl_cc/s_axi_aclk] [get_bd_pins psr_ctrl_interconnect/slowest_sync_clk] \
  [get_bd_pins interconnect_ddrmem_ctrl/aclk] [get_bd_pins vip_ctrl_DDR4_MEM00/aclk] [get_bd_pins vip_ctrl_DDR4_MEM01/aclk] \
  [get_bd_pins ddr4_mem00_ctrl_cc/s_axi_aclk]
connect_bd_net [get_bd_pins ddr4_mem01_sys_rst] [get_bd_pins ddr4_mem01/sys_rst]
connect_bd_net [get_bd_pins vip_ui_clk_DDR4_MEM01/clk_out] \
  [get_bd_pins ddr4_mem01_ui_clk] [get_bd_pins ddr4_mem01_ctrl_cc/m_axi_aclk] [get_bd_pins vip_DDR4_MEM01/aclk] \
  [get_bd_pins psr_ddr4_mem01/slowest_sync_clk]
connect_bd_net [get_bd_pins calib_reduce/Res] [get_bd_pins ddr4_mem_calib_complete]
connect_bd_net [get_bd_pins calib_vector_concat/dout] [get_bd_pins ddr4_mem_calib_vec]
connect_bd_net [get_bd_pins aclk] \
  [get_bd_pins plram_mem01/s_axi_aclk] [get_bd_pins vip_PLRAM_MEM00/aclk] [get_bd_pins vip_PLRAM_MEM01/aclk] \
  [get_bd_pins plram_mem00/s_axi_aclk]
connect_bd_net -net psr_aclk_SLR0_interconnect_aresetn [get_bd_pins aresetn] \
  [get_bd_pins vip_PLRAM_MEM00/aresetn] [get_bd_pins plram_mem00/s_axi_aresetn]
connect_bd_net -net psr_aclk_SLR1_interconnect_aresetn [get_bd_pins aresetn1] \
  [get_bd_pins vip_PLRAM_MEM01/aresetn] [get_bd_pins plram_mem01/s_axi_aresetn]
connect_bd_net [get_bd_pins aresetn2] [get_bd_pins psr_ctrl_interconnect/ext_reset_in]

current_bd_instance /
connect_bd_intf_net -intf_net ddr4_mem01_C0_DDR4 [get_bd_intf_ports DDR4_MEM01] [get_bd_intf_pins memory/DDR4_MEM01]
connect_bd_intf_net -intf_net ddr4_mem00_C0_DDR4 [get_bd_intf_ports DDR4_MEM00] [get_bd_intf_pins memory/DDR4_MEM00]
connect_bd_intf_net [get_bd_intf_ports DDR4_MEM00_DIFF_CLK] [get_bd_intf_pins memory/DDR4_MEM00_DIFF_CLK]
connect_bd_intf_net [get_bd_intf_ports S08_AXI] [get_bd_intf_pins interconnect/S08_AXI]
connect_bd_intf_net [get_bd_intf_ports S01_AXI] [get_bd_intf_pins interconnect/S01_AXI]
connect_bd_intf_net [get_bd_intf_ports S02_AXI] [get_bd_intf_pins interconnect/S02_AXI]
connect_bd_intf_net [get_bd_intf_ports S04_AXI] [get_bd_intf_pins interconnect/S04_AXI]
connect_bd_intf_net -intf_net interconnect_DDR4_MEM00_M00_AXI [get_bd_intf_pins interconnect/M00_AXI] [get_bd_intf_pins memory/S_AXI]
connect_bd_intf_net -intf_net interconnect_DDR4_MEM01_M00_AXI [get_bd_intf_pins interconnect/M00_AXI1] [get_bd_intf_pins memory/S_AXI1]
connect_bd_intf_net [get_bd_intf_ports DDR4_MEM01_DIFF_CLK] [get_bd_intf_pins memory/DDR4_MEM01_DIFF_CLK]
connect_bd_intf_net [get_bd_intf_ports S_AXI_CTRL] [get_bd_intf_pins memory/S_AXI_CTRL]
connect_bd_intf_net [get_bd_intf_ports S00_AXI] [get_bd_intf_pins interconnect/S00_AXI]
connect_bd_intf_net [get_bd_intf_ports S05_AXI] [get_bd_intf_pins interconnect/S05_AXI]
connect_bd_intf_net [get_bd_intf_ports S06_AXI] [get_bd_intf_pins interconnect/S06_AXI]
connect_bd_intf_net [get_bd_intf_ports S07_AXI] [get_bd_intf_pins interconnect/S07_AXI]
connect_bd_intf_net -intf_net interconnect_PLRAM_MEM01_M00_AXI [get_bd_intf_pins interconnect/M00_AXI3] [get_bd_intf_pins memory/S_AXI3]
connect_bd_intf_net -intf_net rs_M00_AXI_M_AXI [get_bd_intf_ports M00_AXI] [get_bd_intf_pins interconnect/M00_AXI4]
connect_bd_intf_net -intf_net interconnect_PLRAM_MEM00_M00_AXI [get_bd_intf_pins interconnect/M00_AXI2] [get_bd_intf_pins memory/S_AXI2]
connect_bd_net [get_bd_ports aresetn] [get_bd_pins reset/aresetn] [get_bd_pins memory/aresetn2]
connect_bd_net [get_bd_ports aclk] [get_bd_pins reset/aclk] [get_bd_pins interconnect/aclk] [get_bd_pins memory/aclk]
connect_bd_net -net aclk1_1 [get_bd_ports aclk1] [get_bd_pins memory/aclk1]
connect_bd_net -net aclk2_1 [get_bd_ports aclk2] [get_bd_pins reset/aclk2] [get_bd_pins interconnect/aclk2]
connect_bd_net -net psr_aclk_SLR0_interconnect_aresetn [get_bd_pins reset/interconnect_aresetn] \
  [get_bd_pins interconnect/aresetn] [get_bd_pins memory/aresetn]
connect_bd_net -net psr_aclk_SLR1_interconnect_aresetn [get_bd_pins reset/interconnect_aresetn1] \
  [get_bd_pins interconnect/aresetn1] [get_bd_pins memory/aresetn1]
connect_bd_net [get_bd_ports ddr4_mem00_sys_rst] [get_bd_pins memory/ddr4_mem00_sys_rst]
connect_bd_net [get_bd_ports ddr4_mem01_sys_rst] [get_bd_pins memory/ddr4_mem01_sys_rst]
connect_bd_net -net calib_reduce_Res [get_bd_pins memory/ddr4_mem_calib_complete] [get_bd_ports ddr4_mem_calib_complete]
connect_bd_net -net calib_vector_concat_dout [get_bd_pins memory/ddr4_mem_calib_vec] [get_bd_ports ddr4_mem_calib_vec]
connect_bd_net -net psr_aclk2_SLR1_interconnect_aresetn [get_bd_pins reset/interconnect_aresetn2] [get_bd_pins interconnect/aresetn2]
connect_bd_net -net vip_ui_clk_DDR4_MEM00_clk_out [get_bd_pins memory/ddr4_mem00_ui_clk] \
  [get_bd_ports ddr4_mem00_ui_clk] [get_bd_pins interconnect/ddr4_mem00_ui_clk]
connect_bd_net -net vip_ui_clk_DDR4_MEM01_clk_out [get_bd_pins memory/ddr4_mem01_ui_clk] \
  [get_bd_ports ddr4_mem01_ui_clk] [get_bd_pins interconnect/ddr4_mem01_ui_clk]

# ---- address map ----
assign_bd_address -offset 0x3000000000 -range 128K -target_address_space [get_bd_addr_spaces S00_AXI] [get_bd_addr_segs memory/plram_mem00/S_AXI/Mem0]
assign_bd_address -offset 0x4000000000 -range 16G -target_address_space [get_bd_addr_spaces S00_AXI] [get_bd_addr_segs memory/ddr4_mem00/C0_DDR4_MEMORY_MAP/C0_DDR4_ADDRESS_BLOCK]
assign_bd_address -offset 0x5000000000 -range 16G -target_address_space [get_bd_addr_spaces S01_AXI] [get_bd_addr_segs M00_AXI/Reg]
assign_bd_address -offset 0x3000200000 -range 128K -target_address_space [get_bd_addr_spaces S02_AXI] [get_bd_addr_segs memory/plram_mem01/S_AXI/Mem0]
assign_bd_address -offset 0x6000000000 -range 16G -target_address_space [get_bd_addr_spaces S02_AXI] [get_bd_addr_segs memory/ddr4_mem01/C0_DDR4_MEMORY_MAP/C0_DDR4_ADDRESS_BLOCK]
assign_bd_address -offset 0x3000000000 -range 128K -target_address_space [get_bd_addr_spaces S04_AXI] [get_bd_addr_segs memory/plram_mem00/S_AXI/Mem0]
assign_bd_address -offset 0x4000000000 -range 16G -target_address_space [get_bd_addr_spaces S05_AXI] [get_bd_addr_segs memory/ddr4_mem00/C0_DDR4_MEMORY_MAP/C0_DDR4_ADDRESS_BLOCK]
assign_bd_address -offset 0x5000000000 -range 16G -target_address_space [get_bd_addr_spaces S06_AXI] [get_bd_addr_segs M00_AXI/Reg]
assign_bd_address -offset 0x6000000000 -range 16G -target_address_space [get_bd_addr_spaces S07_AXI] [get_bd_addr_segs memory/ddr4_mem01/C0_DDR4_MEMORY_MAP/C0_DDR4_ADDRESS_BLOCK]
assign_bd_address -offset 0x3000200000 -range 128K -target_address_space [get_bd_addr_spaces S08_AXI] [get_bd_addr_segs memory/plram_mem01/S_AXI/Mem0]
assign_bd_address -offset 0x1000000 -range 64K -target_address_space [get_bd_addr_spaces S_AXI_CTRL] [get_bd_addr_segs memory/ddr4_mem00/C0_DDR4_MEMORY_MAP_CTRL/C0_REG]
assign_bd_address -offset 0x1010000 -range 64K -target_address_space [get_bd_addr_spaces S_AXI_CTRL] [get_bd_addr_segs memory/ddr4_mem01/C0_DDR4_MEMORY_MAP_CTRL/C0_REG]

validate_bd_design
save_bd_design
